# Altium project TEST-MODULE.PrjPcb
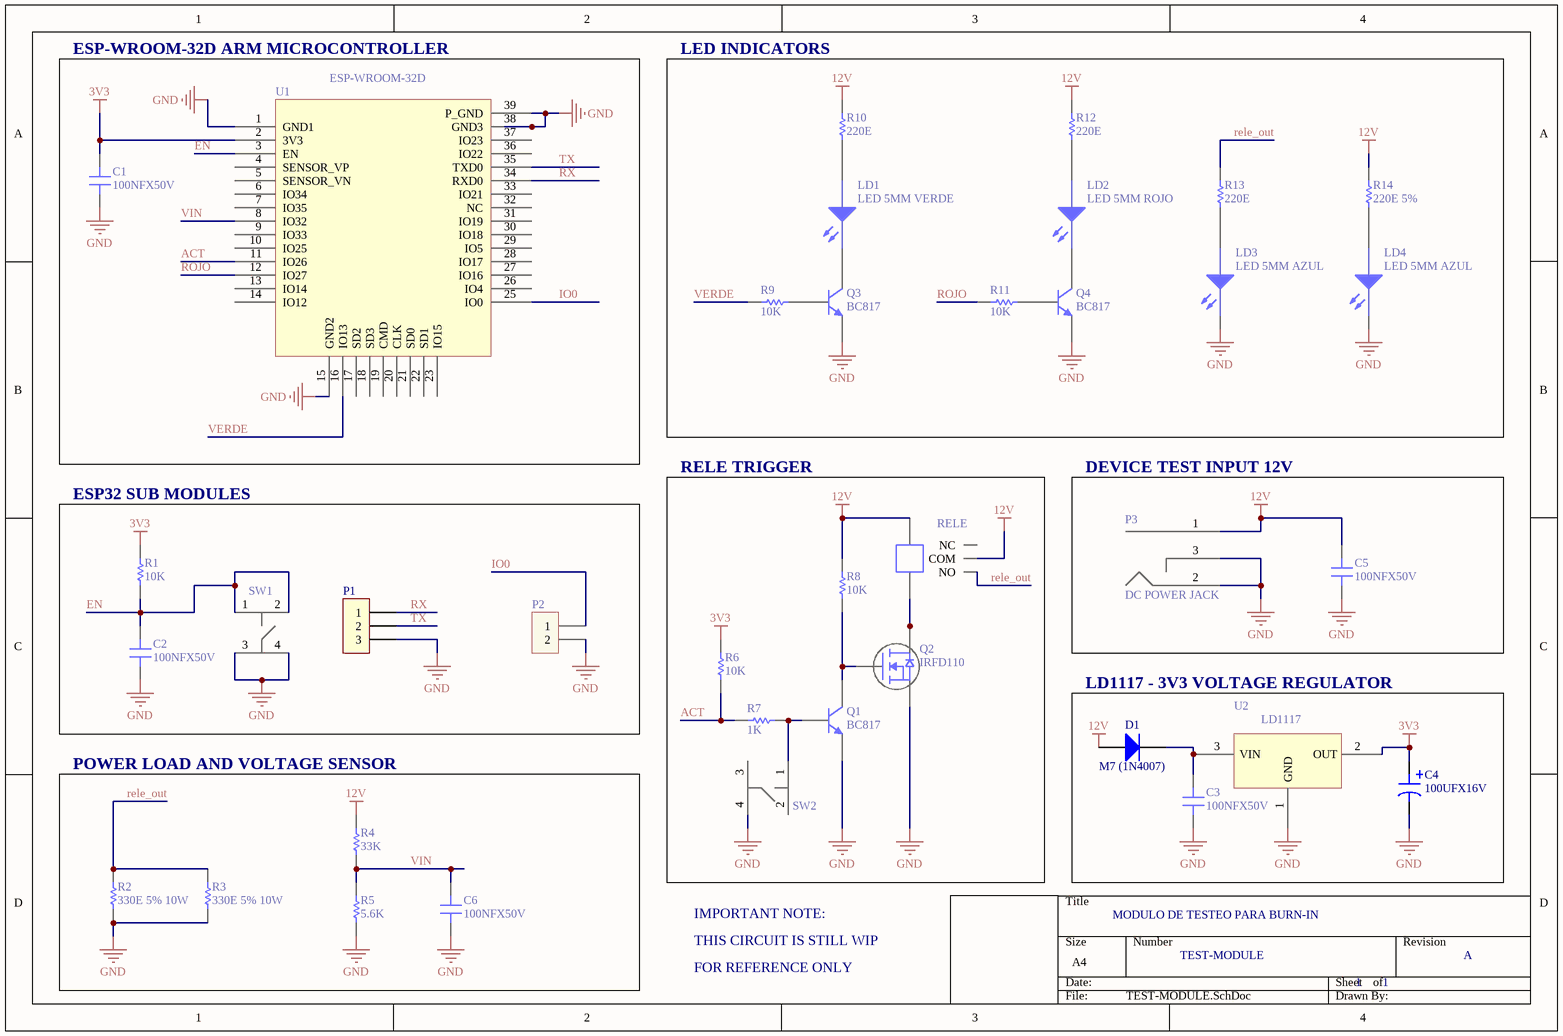
[diagram p0: TEST-MODULE.SchDoc]
1 sheet, 37 parts. Net scope: global (net labels, ports and power ports of the same name join across sheets).
Board files: TEST-MODULE.PcbDoc, TEST-MODULE-PANELIZADO.PcbDoc, TEST-MODULE-DETAILS.PcbDoc

## Sheet TEST-MODULE.SchDoc
size A4

### Parts
C1  100NFX50V  [CAP.SMD.0805]
C2  100NFX50V  [CAP.SMD.0805]
C3  100NFX50V  [CAP.SMD.0805]
C4  100UFX16V  [CAP-ELEC-SMD]
C5  100NFX50V  [CAP.SMD.0805]
C6  100NFX50V  [CAP.SMD.0805]
D1  M7 (1N4007)  [Diode-SMD-SMA]
LD1  LED 5MM VERDE  [LED-5MM-ALTO-9-VERDE]
LD2  LED 5MM ROJO  [LED-5MM-ALTO-9-ROJO]
LD3  LED 5MM AZUL  [LED-5MM-ALTO-9-AZUL]
LD4  LED 5MM AZUL  [LED-5MM-ALTO-9-AZUL]
P1  IDC-MA-THT-1X3-P2.54MM-L11  [IDC-MA-THT-1X3-P2.54MM-L11]  (value not drawn)
P2  IDC-MA-THT-1X2-P2.54MM-L11  [IDC-MA-THT-1X2-P2.54MM-L11]  (value not drawn)
P3  DC POWER JACK  [VAR-DC-JACK - VERT]
Q1  BC817  [NPN.SMD.SOT23]
Q2  IRFD110  [TRA-IRFD110]
Q3  BC817  [NPN.SMD.SOT23]
Q4  BC817  [NPN.SMD.SOT23]
R1  10K  [RES.SMD.103]
R2  330E 5% 10W  [RES-CERAMICA-10W]
R3  330E 5% 10W  [RES-CERAMICA-10W]
R4  33K  [RES.SMD.333]
R5  5.6K  [RES.SMD.562]
R6  10K  [RES.SMD.103]
R7  1K  [RES.SMD.102]
R8  10K  [RES.SMD.103]
R9  10K  [RES.SMD.103]
R10  220E  [RES.SMD.221]
R11  10K  [RES.SMD.103]
R12  220E  [RES.SMD.221]
R13  220E  [RES.SMD.221]
R14  220E 5%  [RES.SMD.221]
RELE  Relay simple inversor 12V 12A  [RELAY 12V 12A CHICO]  (value not drawn)
SW1  TACT-SWITCH-THT-4C-06X06(5MM)  [TACT-SWITCH-THT-4C-06X06-5MM]  (value not drawn)
SW2  TACT-SWITCH-THT-4C-06X06(13MM)-JIANFU  [TACT-SWITCH-THT-4C-06X06-13MM]  (value not drawn)
U1  ESP32-WROOM-32D  [ESP32-WROOM-32D]  (value not drawn)
U2  LD1117S33TR SMD DPAK 0.8A 3.3V LDO LINEAR REGULATOR  [DPAK]  (value not drawn)

### Blocks framed on the sheet
ESP-WROOM-32D ARM MICROCONTROLLER: C1 U1
LED INDICATORS: LD1-LD4 Q3 Q4 R9-R14
ESP32 SUB MODULES: C2 P1 P2 R1 SW1
RELE TRIGGER: Q1 Q2 R6-R8 RELE SW2
DEVICE TEST INPUT 12V: C5 P3
LD1117 - 3V3 VOLTAGE REGULATOR: C3 C4 D1 U2
POWER LOAD AND VOLTAGE SENSOR: C6 R2-R5

### Nets
3V3: C1.2 C4.2 R1.2 R6.2 U1.2(3V3) U2.2(OUT)
12V: C5.2 D1.A P3.1 R4.2 R8.2 R10.2 R12.2 R14.2 RELE.1 RELE.3(COM)
GND: C1.1 C2.1 C3.1 C4.1 C5.1 C6.1 LD3.K(KB) LD4.K(KB) P1.3 P2.2 P3.2 P3.3 Q1.2(E) Q2.4 Q3.2(E) Q4.2(E) R2.1 R3.1 R5.1 SW1.3 SW1.4 SW2.4 U1.1(GND1) U1.15(GND2) U1.38(GND3) U1.39(P_GND) U2.1(GND)
ACT: R6.1 R7.1 U1.11(IO26)
EN: C2.2 R1.1 SW1.1 SW1.2 U1.3(EN)
IO0: P2.1 U1.25(IO0)
rele_out: R2.2 R3.2 R13.2 RELE.4(NO)
ROJO: R11.2 U1.12(IO27)
RX: P1.1 U1.34(RXD0)
TX: P1.2 U1.35(TXD0)
VERDE: R9.1 U1.16(IO13)
VIN: C6.2 R4.1 R5.2 U1.8(IO32)
NetC3_2: C3.2 D1.K U2.3(VIN)
NetLD1_A: LD1.A(AB) R10.1
NetLD1_K: LD1.K(KB) Q3.3(C)
NetLD2_A: LD2.A(AB) R12.1
NetLD2_K: LD2.K(KB) Q4.3(C)
NetLD3_A: LD3.A(AB) R13.1
NetLD4_A: LD4.A(AB) R14.1
NetQ1_1: Q1.1(B) R7.2 SW2.1
NetQ1_3: Q1.3(C) Q2.3 R8.1
NetQ2_1: Q2.1 Q2.2 RELE.2
NetQ3_1: Q3.1(B) R9.2
NetQ4_1: Q4.1(B) R11.1

Not connected (* = marked no-connect by the designer): RELE 5(NC); SW2 2 3; U1 4(SENSOR_VP) 5(SENSOR_VN) 6(IO34) 7(IO35) 9(IO33) 10(IO25) 13(IO14) 14(IO12) 17(SD2) 18(SD3) 19(CMD) 20(CLK) 21(SD0) 22(SD1) 23(IO15) 26(IO4) 27(IO16) 28(IO17) 29(IO5) 30(IO18) 31(IO19) 32(NC) 33(IO21) 36(IO22) 37(IO23)

### Notes on the sheet
- IMPORTANT NOTE:
- MODULO DE TESTEO PARA BURN-IN
- THIS CIRCUIT IS STILL WIP
- FOR REFERENCE ONLY
- TEST-MODULE
- 1
- A
- (in symbol ESP32-WROOM-32D) ESP-WROOM-32D
- (in symbol LD1117S33TR SMD DPAK 0.8A 3.3V LDO LINEAR REGULATOR) LD1117

### Library data of the parts
C1-C3 C5 C6 = Capacitor 100NFX50V X7R 10% CER.MULT. SMD 0805: 100NFX50V X7R 10% CER.MULT. SMD 0805; COD. ELEMON: CA3279774; COD. FV: CE.CAP.0008
C4 = Capacitor Electrolitico SMD 100UFX16V 20%. 6.3x5.3 ELE.RAD.SMD [R=]: 100UFX16V 20%. 6.3x5.3 ELE.RAD.SMD [R=]; COD. ELEMON: CA3629130; COD. FV: CE.CAP.0006
D1 = Diodo M7 DIODO 1A 1000V SMD-SMA (1N4007) XYG: M7 DIODO 1A 1000V SMD-SMA (1N4007) XYG; COD. ELEMON: DI1202221
LD1 = LED 5MM VERDE ALTO 9
LD2 = LED 5MM ROJO ALTO 9
LD3 LD4 = LED 5MM AZUL ALTO 9
P1 = IDC-MA-THT-1X3-P2.54MM-L11: COD. ELEMON: CO496C20
P2 = IDC-MA-THT-1X2-P2.54MM-L11: COD. ELEMON: CO496C20
P3 = DC POWER JACK VERTICAL 2MM
Q1 Q3 Q4 = Transistor BC817-40 TRA.NPN 45V0.5A 0.25W SOT23: BC817-40 TRA.NPN 45V0.5A 0.25W SOT23; COD. ELEMON: TR1723020; COD. FV: CE.TRA.0002
Q2 = Transistor MOSFET N IRFD110: COD. FV: CE.TRA.0003
R1 R6 R8 R9 R11 = Resistencia 10K 5% 0805 1/8W: 10K 5% 0805 1/8W RES.SMD; COD. ELEMON: RS3896245; COD. FV: CE.RES.0014
R2 R3 = Resistencia Ceramica 330E 5% 10W SE15 RES.CEM: COD. ELEMON: RS4096155
R4 = Resistencia 33K 5% 0805 1/8W: 33K 5% 0805 1/8W RES.SMD; COD. ELEMON: RS3896275; COD. FV: CE.RES.0015
R5 = Resistencia 5.6K 5% 0805 1/8W: 5.6K 5% 0805 1/8W RES.SMD; COD. ELEMON: RS3896230
R7 = Resistencia 1K 5% 0805 1/8W: 1K 5% 0805 1/8W RES.SMD; COD. ELEMON: RS3896185; COD. FV: CE.RES.0012
R10 R12-R14 = Resistencia 220E 5% 0805 1/8W: 220E 5% 0805 1/8W RES.SMD; COD. ELEMON: RS3896145
RELE = VAR-RELE-12V Relay simple inversor chico 12V 12A
SW1 = TACT-SWITCH-THT-4C-06X06(5MM): COD. ELEMON: SW5702101
SW2 = TACT-SWITCH-THT-4C-06X06(13MM)-JIANFU: COD. ELEMON: SW5702124
U1 = ESP32-WROOM-32D: COD. ELEMON: RF9301435